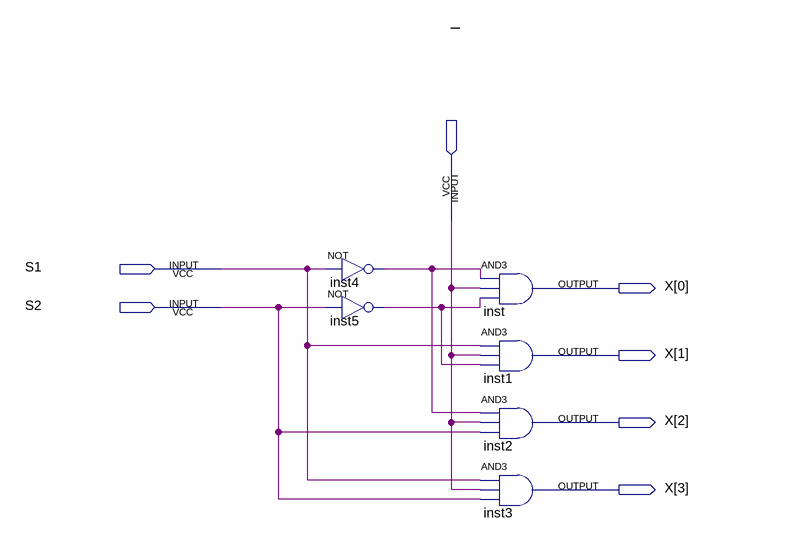
[diagram p0: schematic sheet]
// Quartus schematic demux_1x4.bdf as structural Verilog: 6 symbols, 7 pins
module demux_1x4 (
  input  I,
  input  S1,
  input  S2,
  output [3:0] X
);

  wire inst4_out, inst5_out;

  not inst4 (inst4_out, S1);
  not inst5 (inst5_out, S2);
  and inst (X[0], inst4_out, I, inst5_out);
  and inst1 (X[1], S1, I, inst5_out);
  and inst2 (X[2], inst4_out, I, S2);
  and inst3 (X[3], S1, I, S2);
endmodule
